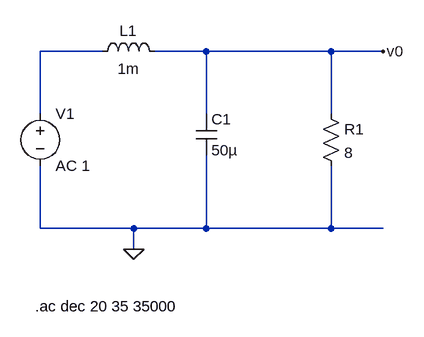
[diagram p0: schematic lowpass.asc]
lowpass.asc, the LTspice schematic file:
Version 4
SHEET 1 880 680
WIRE 112 0 16 0
WIRE 272 0 192 0
WIRE 464 0 272 0
WIRE 544 0 464 0
WIRE 16 96 16 0
WIRE 272 96 272 0
WIRE 464 96 464 0
WIRE 16 272 16 176
WIRE 160 272 16 272
WIRE 272 272 272 160
WIRE 272 272 160 272
WIRE 464 272 464 176
WIRE 464 272 272 272
WIRE 544 272 464 272
WIRE 160 304 160 272
FLAG 160 304 0
FLAG 544 0 v0
SYMBOL voltage 16 80 R0
WINDOW 123 0 0 Left 0
WINDOW 39 0 0 Left 0
SYMATTR InstName V1
SYMATTR Value AC 1
SYMBOL ind 96 16 R270
WINDOW 0 32 56 VTop 2
WINDOW 3 5 56 VBottom 2
SYMATTR InstName L1
SYMATTR Value 1m
SYMBOL cap 256 96 R0
SYMATTR InstName C1
SYMATTR Value 50µ
SYMBOL res 448 80 R0
SYMATTR InstName R1
SYMATTR Value 8
TEXT 8 392 Left 2 !.ac dec 20 35 35000

The netlist it stands for:
* lowpass.asc
V1 N001 0 AC 1
L1 N001 v0 1m
C1 v0 0 50µ
R1 v0 0 8
.ac dec 20 35 35000
.backanno
.end

* Results of the author's LTspice run, read from the files saved beside the schematic
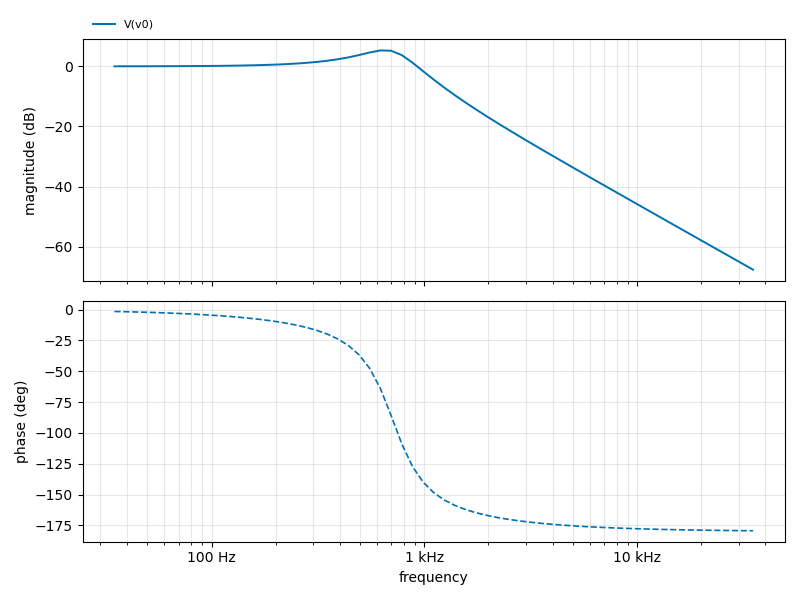
[diagram p1: AC Analysis of lowpass.asc, plotted from the saved traces]
* AC Analysis, 1 run:
*   V(v0): 0.02 dB at 35 Hz, -67.67 dB at 35 kHz, peak 5.31 dB at 622.4 Hz, 3 dB below the peak at 386.1 Hz and 836.9 Hz